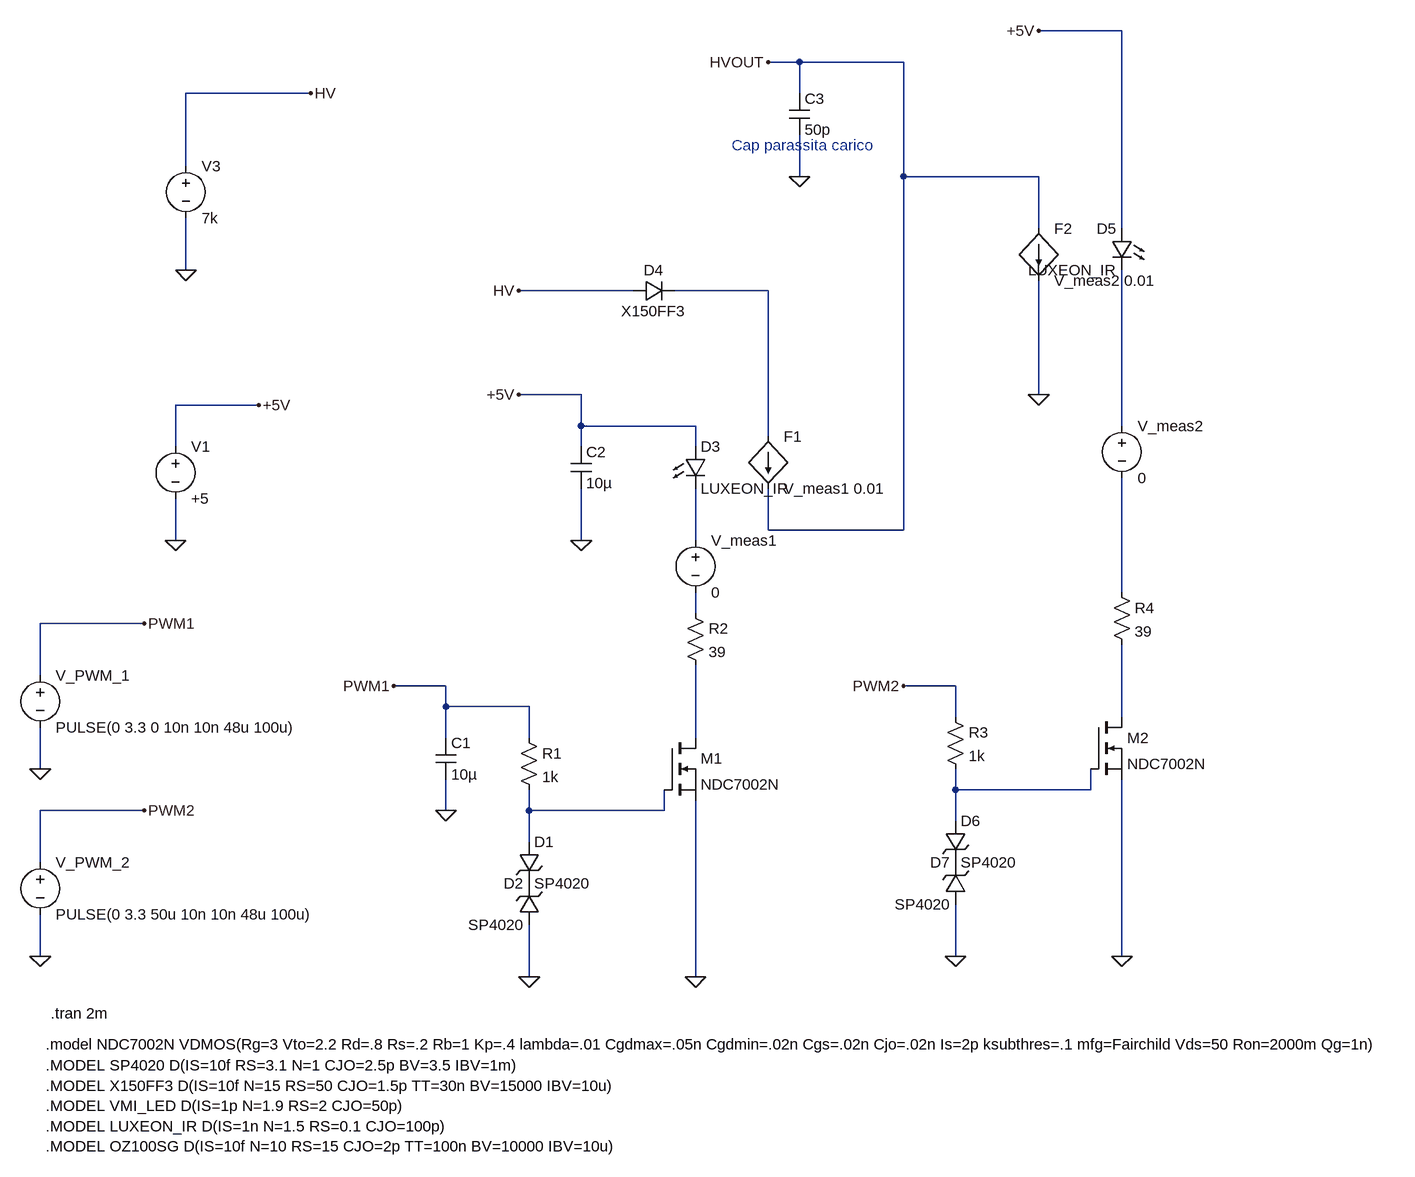
[diagram p0: schematic Channel_act_sym.asc]
Channel_act_sym.asc, the LTspice schematic file:
Version 4.1
SHEET 1 1864 808
WIRE 1264 -912 1136 -912
WIRE 768 -864 720 -864
WIRE 928 -864 768 -864
WIRE 16 -816 -176 -816
WIRE 768 -816 768 -864
WIRE -176 -704 -176 -816
WIRE 768 -688 768 -752
WIRE 928 -688 928 -864
WIRE 1136 -688 928 -688
WIRE 1136 -608 1136 -688
WIRE 1264 -608 1264 -912
WIRE -176 -544 -176 -624
WIRE 512 -512 336 -512
WIRE 720 -512 576 -512
WIRE 432 -352 336 -352
WIRE 1136 -352 1136 -528
WIRE -64 -336 -192 -336
WIRE 432 -304 432 -352
WIRE 608 -304 432 -304
WIRE 1264 -304 1264 -544
WIRE 720 -288 720 -512
WIRE -192 -272 -192 -336
WIRE 432 -272 432 -304
WIRE 608 -272 608 -304
WIRE 720 -144 720 -208
WIRE 928 -144 928 -688
WIRE 928 -144 720 -144
WIRE -192 -128 -192 -192
WIRE 432 -128 432 -208
WIRE 608 -128 608 -208
WIRE 1264 -48 1264 -224
WIRE 608 -16 608 -48
WIRE -240 0 -400 0
WIRE -400 80 -400 0
WIRE 224 96 144 96
WIRE 1008 96 928 96
WIRE 224 128 224 96
WIRE 352 128 224 128
WIRE 1008 144 1008 96
WIRE 1264 144 1264 32
WIRE 224 176 224 128
WIRE 352 176 352 128
WIRE 608 176 608 64
WIRE -400 224 -400 160
WIRE 1008 256 1008 224
WIRE 1216 256 1216 224
WIRE 1216 256 1008 256
WIRE -240 288 -400 288
WIRE 224 288 224 240
WIRE 352 288 352 256
WIRE 560 288 560 256
WIRE 560 288 352 288
WIRE 1008 304 1008 256
WIRE 352 336 352 288
WIRE -400 368 -400 288
WIRE -400 512 -400 448
WIRE 1008 512 1008 432
WIRE 1264 512 1264 240
WIRE 352 544 352 464
WIRE 608 544 608 272
FLAG 224 288 0
FLAG 352 544 0
FLAG 608 544 0
FLAG 432 -128 0
FLAG -192 -128 0
FLAG -400 224 0
FLAG -64 -336 +5V
FLAG 336 -352 +5V
FLAG 336 -512 HV
FLAG 1136 -352 0
FLAG 1008 512 0
FLAG 1264 512 0
FLAG 720 -864 HVOUT
FLAG 1136 -912 +5V
FLAG -176 -544 0
FLAG 16 -816 HV
FLAG -400 512 0
FLAG -240 0 PWM1
FLAG 144 96 PWM1
FLAG -240 288 PWM2
FLAG 928 96 PWM2
FLAG 768 -688 0
SYMBOL cap 208 176 R0
SYMATTR InstName C1
SYMATTR Value 10µ
SYMBOL nmos 560 176 R0
SYMATTR InstName M1
SYMATTR Value NDC7002N
SYMBOL res 336 160 R0
SYMATTR InstName R1
SYMATTR Value 1k
SYMBOL zener 336 336 R0
SYMATTR InstName D1
SYMATTR Value SP4020
SYMBOL zener 368 464 R180
WINDOW 0 24 64 Left 2
WINDOW 3 24 0 Left 2
SYMATTR InstName D2
SYMATTR Value SP4020
SYMBOL res 592 -32 R0
SYMATTR InstName R2
SYMATTR Value 39
SYMBOL LED 592 -272 R0
SYMATTR InstName D3
SYMATTR Value LUXEON_IR
SYMBOL cap 416 -272 R0
SYMATTR InstName C2
SYMATTR Value 10µ
SYMBOL voltage -192 -288 R0
SYMATTR InstName V1
SYMATTR Value +5
SYMBOL voltage -400 64 R0
WINDOW 123 0 0 Left 0
WINDOW 39 0 0 Left 0
SYMATTR InstName V_PWM_1
SYMATTR Value PULSE(0 3.3 0 10n 10n 48u 100u)
SYMBOL diode 512 -496 R270
WINDOW 0 32 32 VTop 2
WINDOW 3 0 32 VBottom 2
SYMATTR InstName D4
SYMATTR Value X150FF3
SYMBOL f 720 -288 R0
SYMATTR InstName F1
SYMATTR Value V_meas1 0.01
SYMBOL f 1136 -608 R0
SYMATTR InstName F2
SYMATTR Value V_meas2 0.01
SYMBOL LED 1280 -608 M0
SYMATTR InstName D5
SYMATTR Value LUXEON_IR
SYMBOL nmos 1216 144 R0
SYMATTR InstName M2
SYMATTR Value NDC7002N
SYMBOL res 992 128 R0
SYMATTR InstName R3
SYMATTR Value 1k
SYMBOL zener 992 304 R0
SYMATTR InstName D6
SYMATTR Value SP4020
SYMBOL zener 1024 432 R180
WINDOW 0 24 64 Left 2
WINDOW 3 24 0 Left 2
SYMATTR InstName D7
SYMATTR Value SP4020
SYMBOL res 1248 -64 R0
SYMATTR InstName R4
SYMATTR Value 39
SYMBOL voltage -176 -720 R0
SYMATTR InstName V3
SYMATTR Value 7k
SYMBOL voltage 608 -144 R0
SYMATTR InstName V_meas1
SYMATTR Value 0
SYMBOL voltage 1264 -320 R0
SYMATTR InstName V_meas2
SYMATTR Value 0
SYMBOL voltage -400 352 R0
WINDOW 123 0 0 Left 0
WINDOW 39 0 0 Left 0
SYMATTR InstName V_PWM_2
SYMATTR Value PULSE(0 3.3 50u 10n 10n 48u 100u)
SYMBOL cap 752 -816 R0
SYMATTR InstName C3
SYMATTR Value 50p
TEXT -392 648 Left 2 !.model NDC7002N VDMOS(Rg=3 Vto=2.2 Rd=.8 Rs=.2 Rb=1 Kp=.4 lambda=.01 Cgdmax=.05n Cgdmin=.02n Cgs=.02n Cjo=.02n Is=2p ksubthres=.1 mfg=Fairchild Vds=50 Ron=2000m Qg=1n)
TEXT -392 680 Left 2 !.MODEL SP4020 D(IS=10f RS=3.1 N=1 CJO=2.5p BV=3.5 IBV=1m)\n.MODEL X150FF3 D(IS=10f N=15 RS=50 CJO=1.5p TT=30n BV=15000 IBV=10u)\n.MODEL VMI_LED D(IS=1p N=1.9 RS=2 CJO=50p) \n.MODEL LUXEON_IR D(IS=1n N=1.5 RS=0.1 CJO=100p)\n.MODEL OZ100SG D(IS=10f N=10 RS=15 CJO=2p TT=100n BV=10000 IBV=10u)
TEXT -384 600 Left 2 !.tran 2m
TEXT 664 -736 Left 2 ;Cap parassita carico

The netlist it stands for:
* Channel_act_sym.asc
C1 PWM1 0 10µ
M1 N007 N009 0 0 NDC7002N
R1 PWM1 N009 1k
D1 N009 P001 SP4020
D2 0 P001 SP4020
R2 N005 N007 39
D3 +5V N003 LUXEON_IR
C2 +5V 0 10µ
V1 +5V 0 +5
V_PWM_1 PWM1 0 PULSE(0 3.3 0 10n 10n 48u 100u)
D4 HV N001 X150FF3
F1 N001 HVOUT V_meas1 0.01
F2 HVOUT 0 V_meas2 0.01
D5 +5V N002 LUXEON_IR
M2 N006 N008 0 0 NDC7002N
R3 PWM2 N008 1k
D6 N008 P002 SP4020
D7 0 P002 SP4020
R4 N004 N006 39
V3 HV 0 7k
V_meas1 N003 N005 0
V_meas2 N002 N004 0
V_PWM_2 PWM2 0 PULSE(0 3.3 50u 10n 10n 48u 100u)
C3 HVOUT 0 50p
.model D D
.lib standard.dio
.model NMOS NMOS
.model PMOS PMOS
.lib standard.mos
.model NDC7002N VDMOS(Rg=3 Vto=2.2 Rd=.8 Rs=.2 Rb=1 Kp=.4 lambda=.01 Cgdmax=.05n Cgdmin=.02n Cgs=.02n Cjo=.02n Is=2p ksubthres=.1 mfg=Fairchild Vds=50 Ron=2000m Qg=1n)
.MODEL SP4020 D(IS=10f RS=3.1 N=1 CJO=2.5p BV=3.5 IBV=1m)
.MODEL X150FF3 D(IS=10f N=15 RS=50 CJO=1.5p TT=30n BV=15000 IBV=10u)
.MODEL VMI_LED D(IS=1p N=1.9 RS=2 CJO=50p)
.MODEL LUXEON_IR D(IS=1n N=1.5 RS=0.1 CJO=100p)
.MODEL OZ100SG D(IS=10f N=10 RS=15 CJO=2p TT=100n BV=10000 IBV=10u)
.tran 2m
* Cap parassita carico
.backanno
.end

* Results of the author's LTspice run, read from the files saved beside the schematic
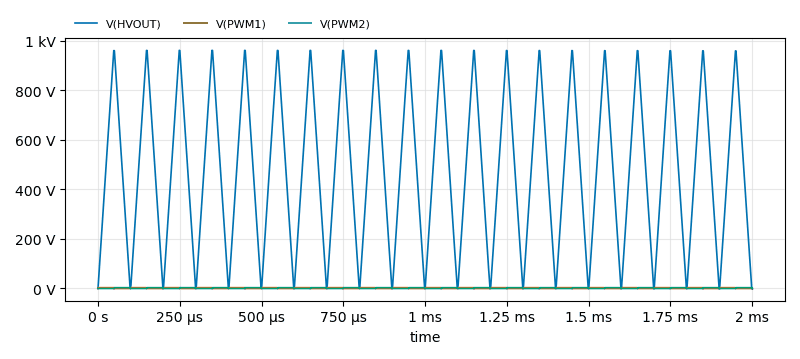
[diagram p1: Transient Analysis of Channel_act_sym.asc, plotted from the saved traces]
* Transient Analysis, 1 run:
*   V(HVOUT): min -1.232 V, max 960.4 V, average 479.9 V, rms 560.3 V, last -1.232 V
*   V(PWM1): min 0 V, max 3.3 V, average 1.584 V, rms 2.287 V, last 0 V
*   V(PWM2): min 0 V, max 3.3 V, average 1.584 V, rms 2.287 V, last 0 V